# EAGLE design light_bulb2 (EAGLE 9.2.1)
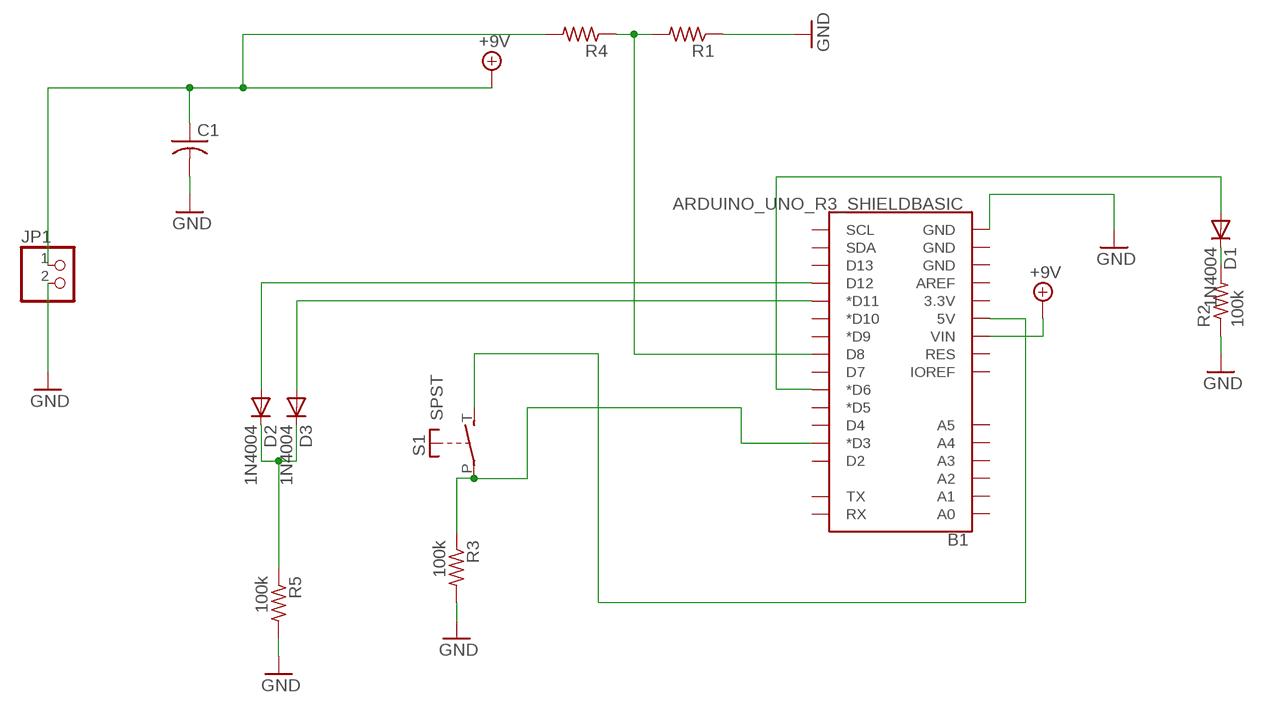
[diagram p0: schematic, sheet 1]

## Parts
B1  ARDUINO_UNO_R3_SHIELDBASIC  [UNO_R3_SHIELD]
C1  0.1  C-USC0805  [C0805]
D1  1N4004  [DO41-10]
D2  1N4004  [DO41-10]
D3  1N4004  [DO41-10]
JP1  PINHD-1X2  [1X02]
R1  15k  R-US_R0805  [R0805]
R2  100k  R-US_R0805  [R0805]
R3  100k  R-US_R0805  [R0805]
R4  20k  R-US_R0805  [R0805]
R5  100k  R-US_R0805  [R0805]
S1  SPST  [JUDCOSPST]

## Nets
+9V: B1.VIN C1.1 JP1.1 R4.2
GND: B1.GND@0(GND) C1.2 JP1.2 R1.1 R2.1 R3.2 R5.2
N$1: B1.5V S1.T(S)
N$2: D1.C R2.2
N$3: B1.D8 R1.2 R4.1
N$4: B1.D3(*D3) R3.1 S1.P
N$6: B1.D6(*D6) D1.A
N$7: B1.D12 D2.A
N$8: B1.D11(*D11) D3.A
N$9: D2.C D3.C R5.1
Unconnected: B1.3.3V B1.A0 B1.A1 B1.A2 B1.A3 B1.A4 B1.A5 B1.AREF B1.D2 B1.D4 B1.D5(*D5) B1.D7 B1.D9(*D9) B1.D10(*D10) B1.D13 B1.GND@1(GND) B1.GND@2(GND) B1.IOREF B1.RES B1.RX B1.SCL B1.SDA B1.TX

## Library data of the parts
B1 = SparkFun-Boards:ARDUINO_UNO_R3_SHIELD: Arduino R3 Shield Footprint Shield form compatible with the Arduino Uno R3. SparkFun Products: MG2639 Cellular Shield <https://www.sparkfun.com/products/13120> MIDI Shield <https://www.sparkfun.com/products/12898> R3 Stackable Headers Kit <https://www.sparkfun.com/products/11417>
C1 = adafruit:C-US: CAPACITOR, American symbol
D1-D3 = diode:1N4004: DIODE general purpose rectifier, 1 A
JP1 = pinhead:PINHD-1X2: PIN HEADER
R1-R5 = adafruit:R-US_: RESISTOR, American symbol
S1 = adafruit:SPST: Judco 50-0015-00

## Net classes
0 default: width 0.508 mm, drill 0.508 mm, clearance 0.305 mm

## Board
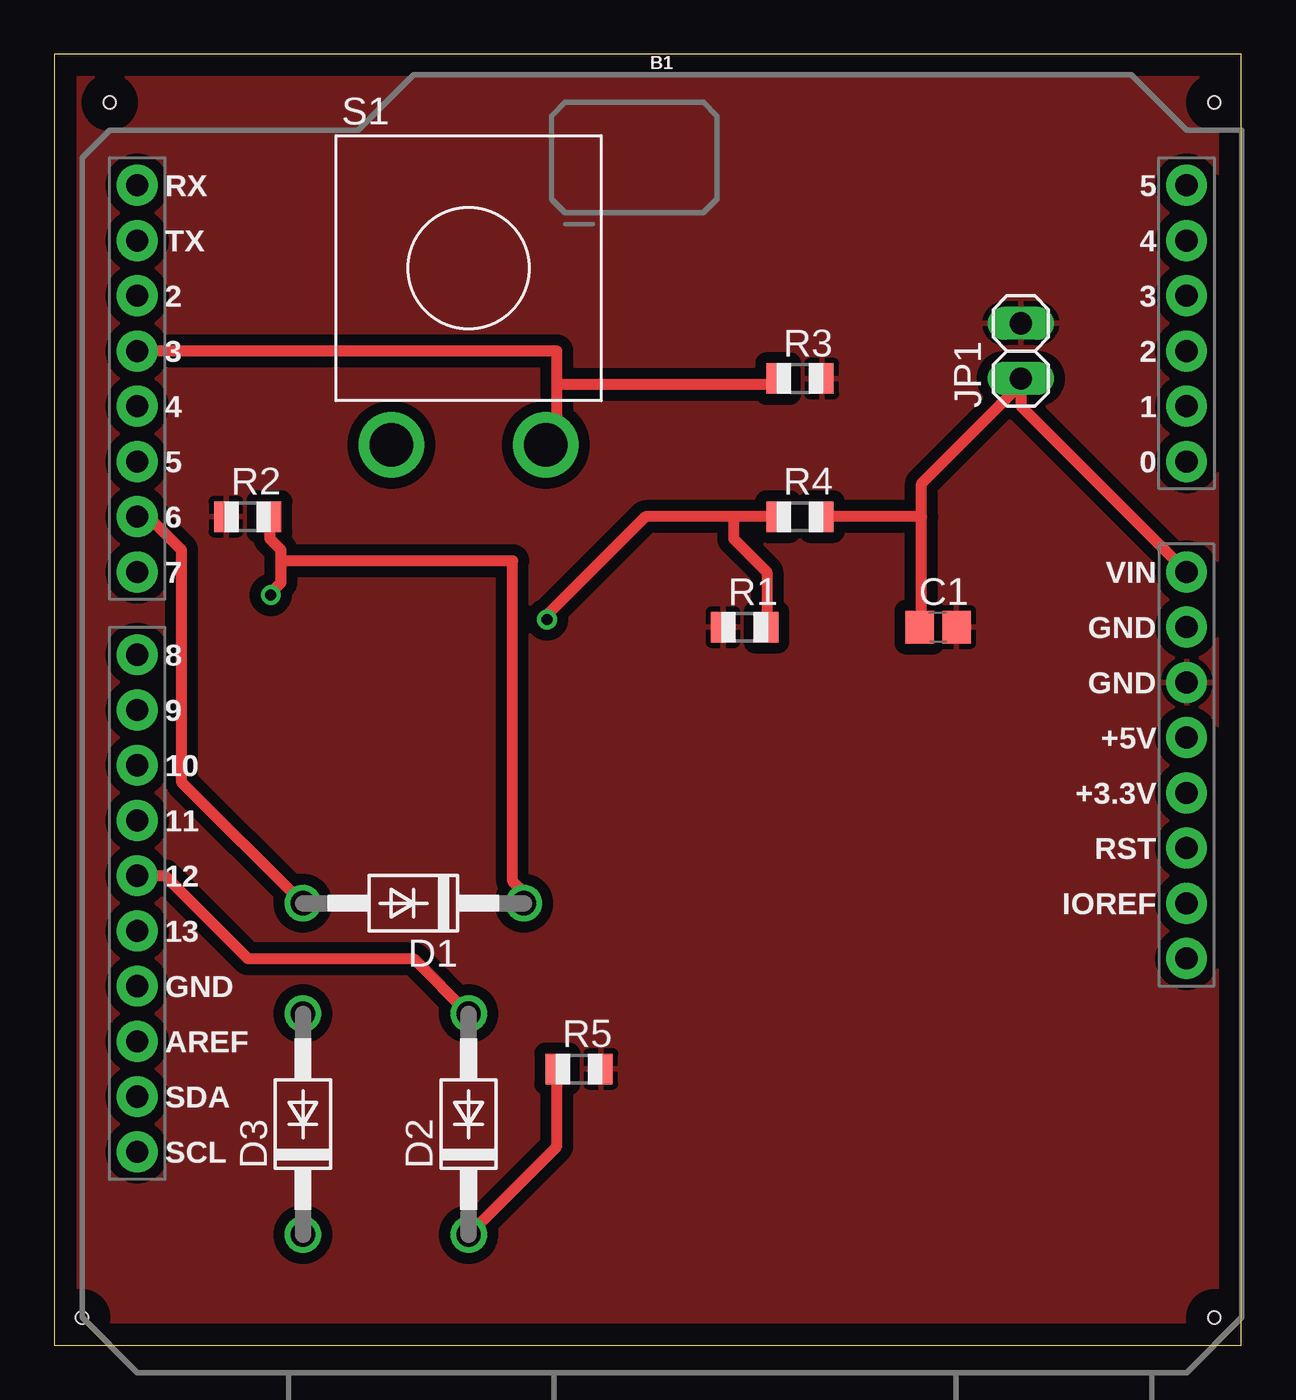
[diagram p1: board, top side]
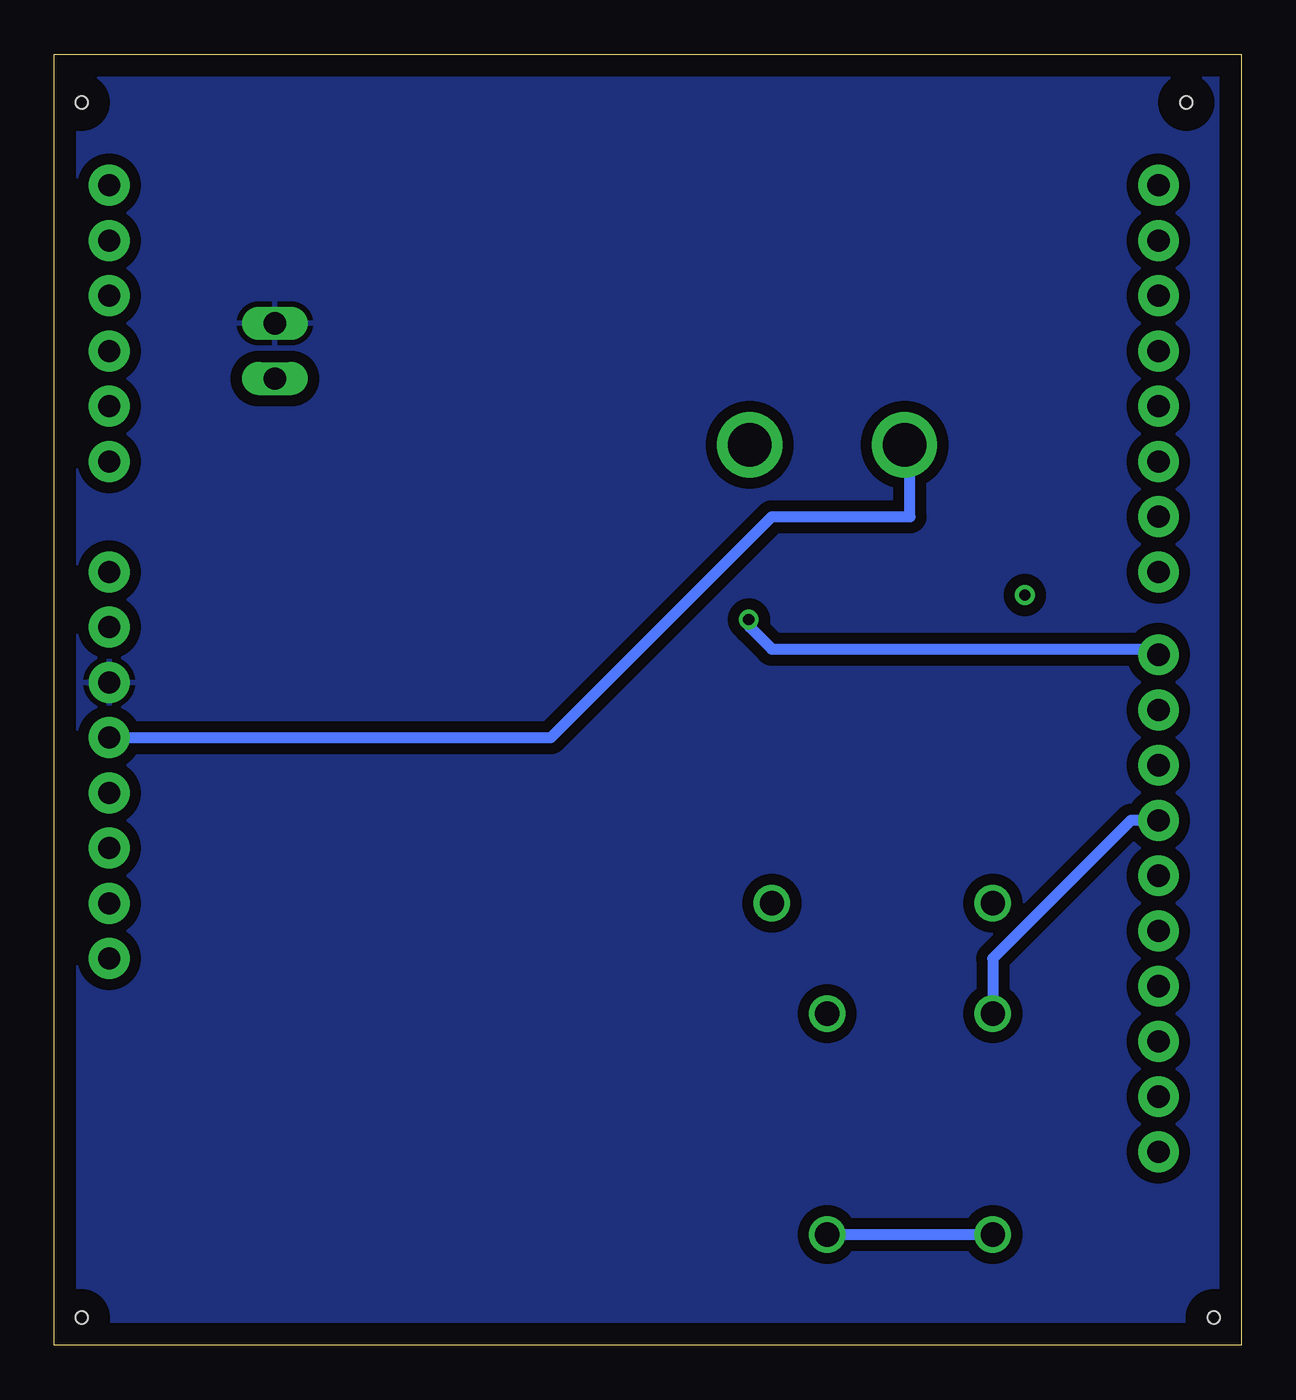
[diagram p2: board, bottom side, seen from below]

Size 54.59 x 59.36 mm. Coordinates in mm from the lower left corner, seen from the top.
Outline: 0,0 54.59,0 54.59,59.36 0,59.36 0,0
Copper layers (1*16): Top 0.035mm / dielectric 1.5mm / Bottom 0.035mm
Design rules "default *": minimum track width 6mil, minimum drill 0.35mm, track to track 20mil, track to pad 20mil, pad to pad 20mil, via to via 20mil, smd to smd 20mil, copper to edge 40mil, drill to drill 6mil, minimum pad ring 10mil, minimum via ring 8mil, stop-mask expansion 4mil, vias tented up to drill 0mil, thermal gap 10mil
Holes 0.55 mm at 1.27,1.27 2.54,57.15 53.34,57.15 53.34,1.27

### Footprints (pad centres in the part's own frame; a part is rotated, then mirrored left to right if it is on the bottom)
UNO_R3_SHIELD = drill 1.016 pad 1.88: 3.3V 24.13,-2.54; 5V 24.13,0; A0 24.13,12.7; A1 24.13,15.24; A2 24.13,17.78; A3 24.13,20.32; A4 24.13,22.86; A5 24.13,25.4; AREF -24.13,-13.97; D2 -24.13,20.32; D3 -24.13,17.78; D4 -24.13,15.24; D5 -24.13,12.7; D6 -24.13,10.16; D7 -24.13,7.62; D8 -24.13,3.81; D9 -24.13,1.27; D10 -24.13,-1.27; D11 -24.13,-3.81; D12 -24.13,-6.35; D13 -24.13,-8.89; GND@0 24.13,2.54; GND@1 24.13,5.08; GND@2 -24.13,-11.43; IOREF 24.13,-7.62; NC 24.13,-10.16; RES 24.13,-5.08; RX -24.13,25.4; SCL -24.13,-19.05; SDA -24.13,-16.51; TX -24.13,22.86; VIN 24.13,7.62
C0805 = smd 1.3 x 1.5: 1 -0.85,0; 2 0.85,0
DO41-10 = drill 1.118: A 5.08,0; C -5.08,0
1X02 = drill 1.016 long: 1 -1.27,0; 2 1.27,0
R0805 = smd 1.1 x 1.4: 1 -1,0; 2 1,0
JUDCOSPST = drill 2: P 3.556,-8.128; T -3.556,-8.128

### Placement (x,y rotation side)
B1  27.94,27.94 0 top
C1  40.64,33.02 0 top
D1  16.51,20.32 180 top
D2  19.05,10.16 90 top
D3  11.43,10.16 90 top
JP1  44.45,45.72 90 top
R1  31.75,33.02 0 top
R2  8.89,38.1 0 top
R3  34.29,44.45 0 top
R4  34.29,38.1 0 top
R5  24.13,12.7 0 top
S1  19.05,49.53 0 top

### Tracks (layer width: path | path; a pad name or v marks a point on that pad's centre or on a via)
+9V
  Top 0.508: 39.88,38.1 R4.2 | 39.88,38.1 39.88,33.02 C1.1 | 44.45,44.2 39.88,39.62 39.88,38.1 | B1.VIN 44.45,43.18 44.45,44.2 | 44.45,44.2 JP1.1
GND
  pour Top: 0,59.69 0,0 54.61,0 54.61,59.69
  pour Bottom: 0,59.69 0,0 54.61,0 54.61,59.69
N$1
  Bottom 0.508: B1.5V 31.75,27.94 21.59,38.1 15.24,38.1 15.24,41.15 S1.T
N$2  (via drill 0.51)
  Top 0.508: 10.41,36.07 10.41,36.58 9.91,37.08 9.91,38.1 R2.2 | 10.41,36.07 10.41,35.05 9.91,34.54 v9.96,34.49 | 10.41,36.07 21.08,36.07 21.08,21.34 21.59,20.83 D1.C
N$3  (via drill 0.51)
  Top 0.508: R4.1 31.24,38.1 | 31.24,38.1 27.18,38.1 22.61,33.53 v22.66,33.38 | 31.24,38.1 31.24,37.08 32.77,35.56 32.77,33.02 R1.2
  Bottom 0.508: B1.D8 3.81,32 21.59,32 22.61,33.02 v22.66,33.38
N$4
  Top 0.508: 23.11,44.2 33.27,44.2 R3.1 | 23.11,44.2 23.11,42.16 22.61,41.66 S1.P | B1.D3 23.11,45.72 23.11,44.2
N$6
  Top 0.508: D1.A 5.84,25.91 5.84,36.58 4.32,38.1 B1.D6
N$7
  Top 0.508: B1.D12 5.08,21.59 8.89,17.78 16.51,17.78 D2.A
N$8
  Bottom 0.508: B1.D11 5.08,24.13 11.43,17.78 D3.A
N$9
  Top 0.508: D2.C 23.11,9.14 23.11,12.7 R5.1
  Bottom 0.508: D3.C D2.C